# EasyEDA schematic SCH_Sega Pad - Amiga Joystick + Autofire_2021-08-13.json
TITLE: Sega Pad -> Amiga/C64 Joystick + Autofire; REV: 1.0; Date: 2021-06-16; Sheet: 1/1; Drawn By: Maciej Miklas; Company: Maciej Miklas
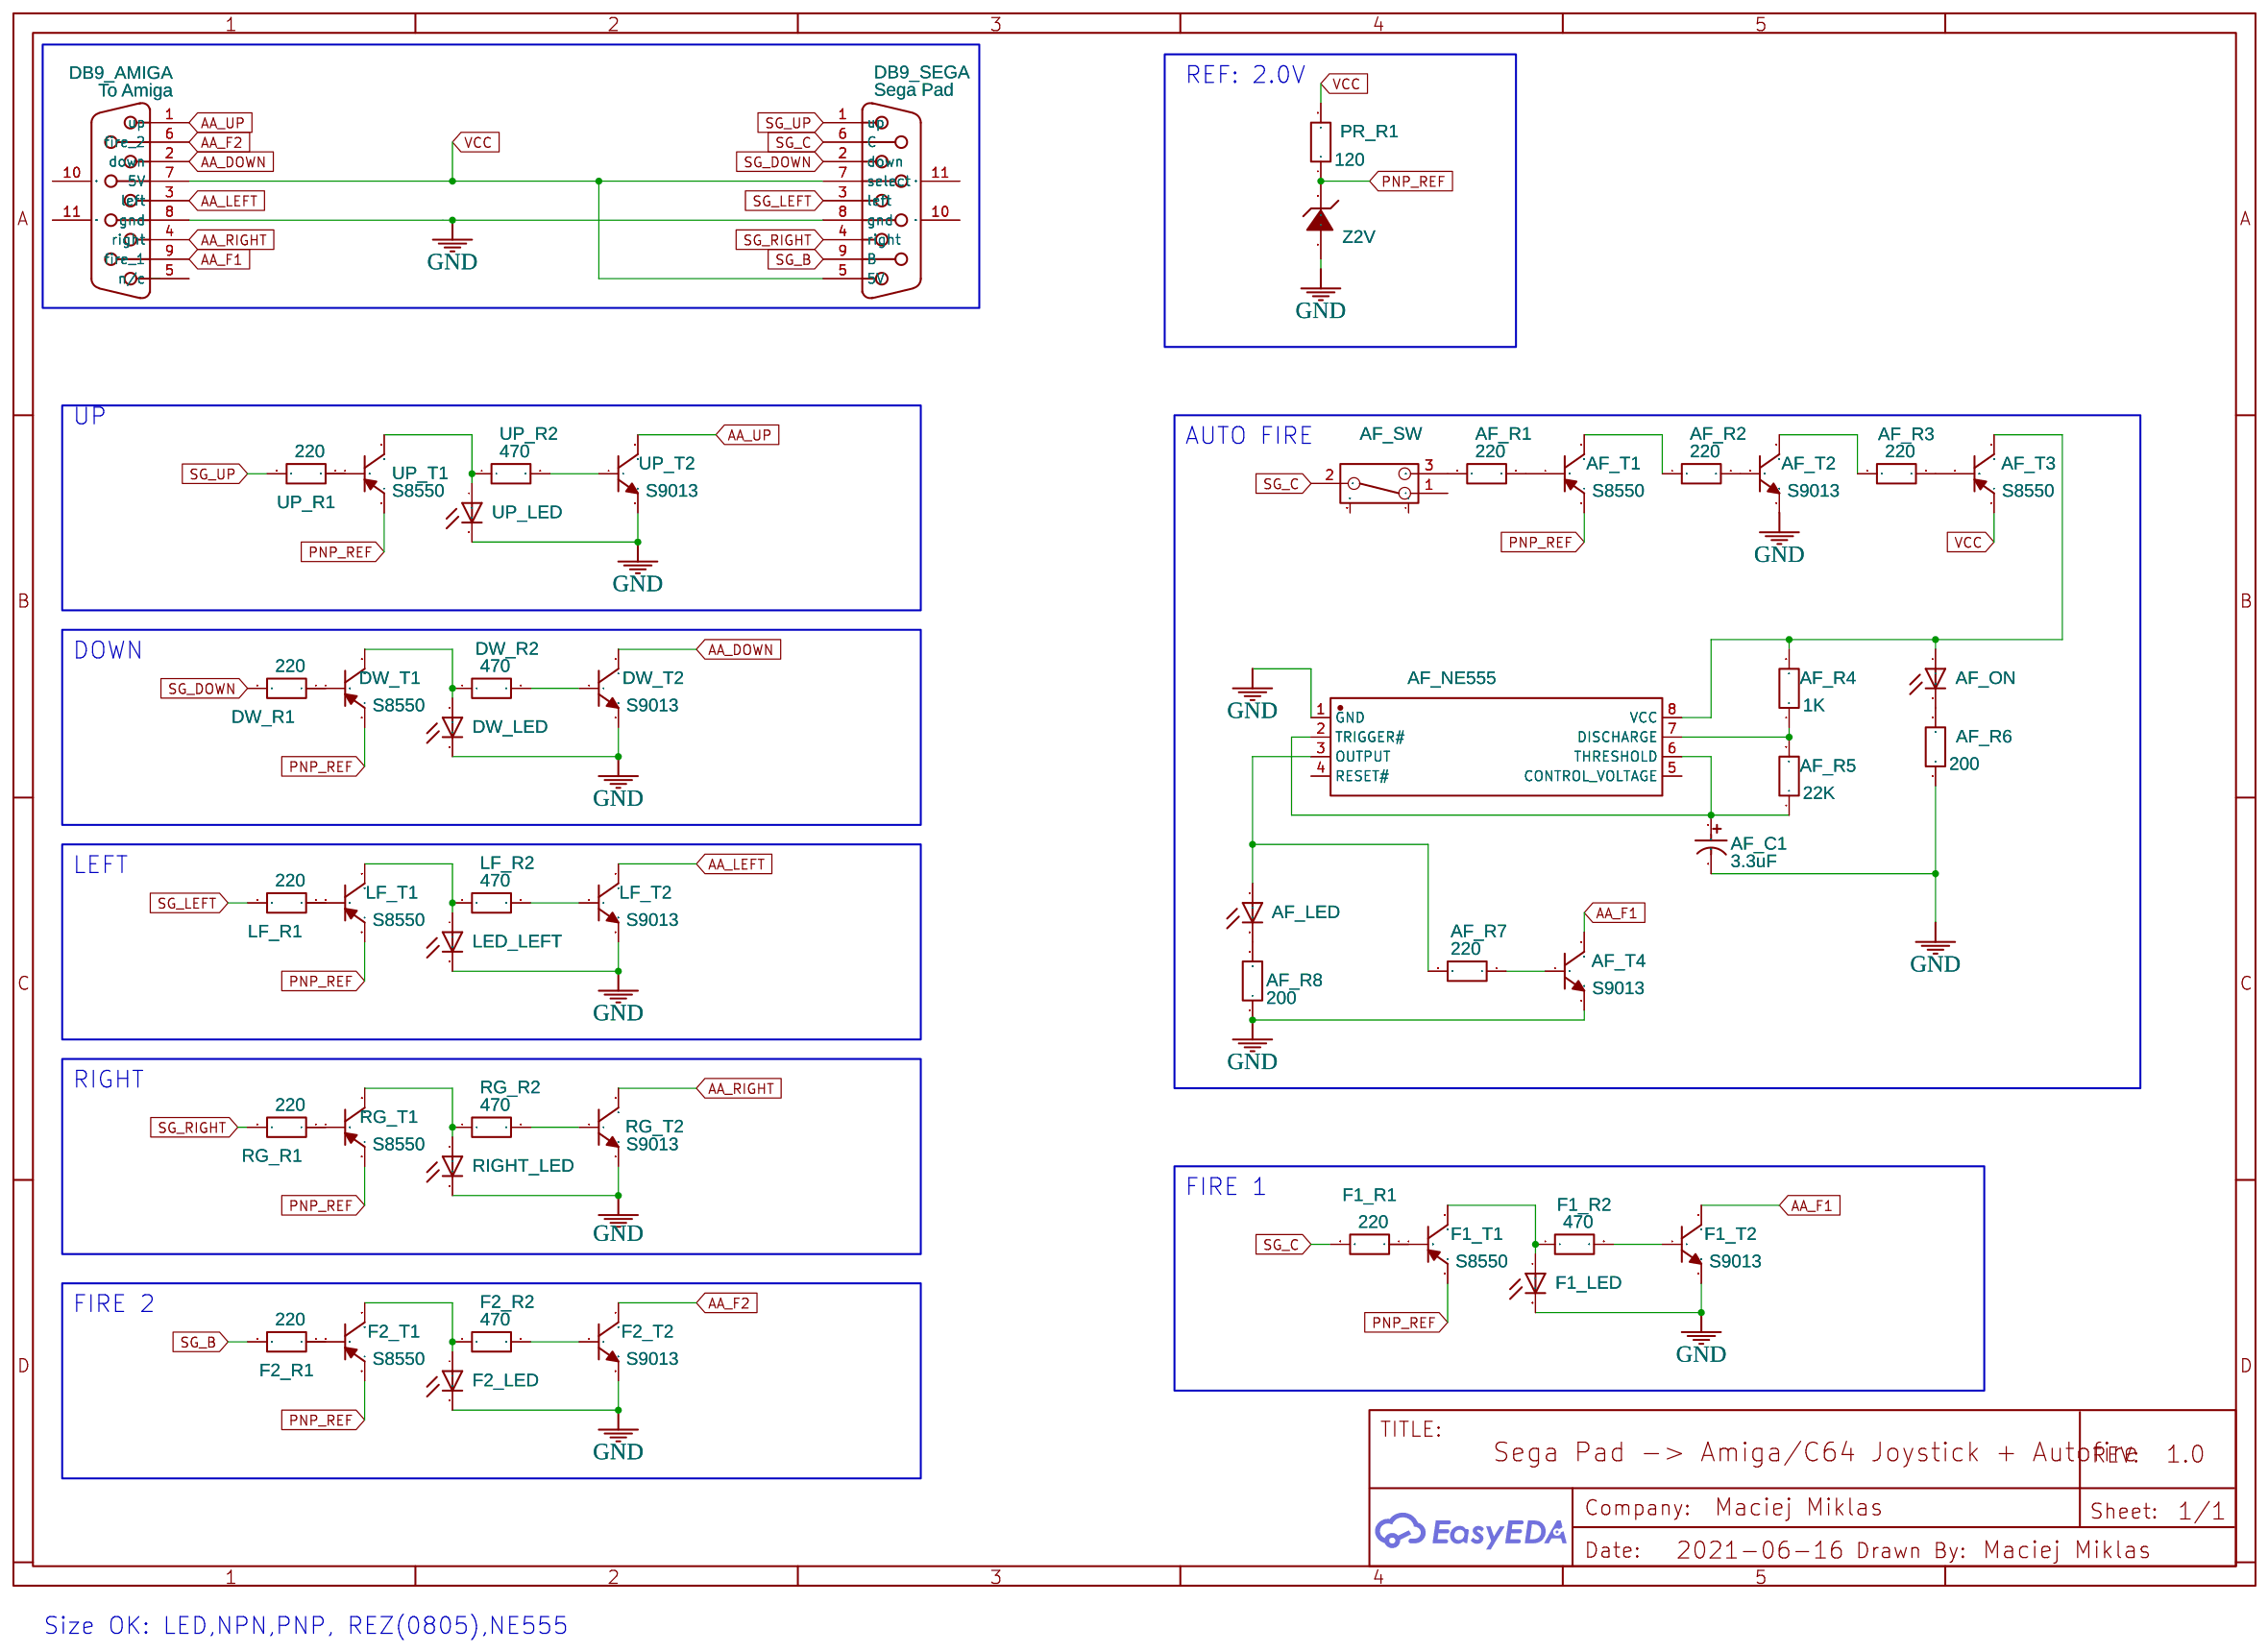
[diagram p0: schematic sheet]

## Parts
AF_555  AF_NE555  [SOP-8_L4.9-W3.9-P1.27-LS6.0-BL]
AF_C1  3.3uF  [CAP-TH_BD5.0-P2.00-D0.8-FD]
AF_LED  LED  [CHIPLED_0603]
AF_ON  LED  [CHIPLED_0603]
AF_R1  220  [R0805]
AF_R2  220  [R0805]
AF_R3  220  [R0805]
AF_R4  1K  [R0805]
AF_R5  22K  [R0805]
AF_R6  200  [R0805]
AF_R7  220  [R0805]
AF_R8  200  [R0805]
AF_SW  AUTOFIRE ON/OFF  [SW-TH_SK-12D02VG3]
AF_T1  S8550  [SOT-23-3_L2.9-W1.3-P1.90-LS2.4-BR]
AF_T2  S9013  [SOT-23-3_L2.9-W1.6-P1.90-LS2.8-BR]
AF_T3  S8550  [SOT-23-3_L2.9-W1.3-P1.90-LS2.4-BR]
AF_T4  S9013  [SOT-23-3_L2.9-W1.6-P1.90-LS2.8-BR]
DB9_AMIGA  To Amiga  [DSUB-TH_DMR-9S]
DB9_SEGA  Sega Pad  [DSUB-TH_DMR-9P]
DW_LED  LED  [CHIPLED_0603]
DW_R1  220  [R0805]
DW_R2  470  [R0805]
DW_T1  S8550  [SOT-23-3_L2.9-W1.3-P1.90-LS2.4-BR]
DW_T2  S9013  [SOT-23-3_L2.9-W1.6-P1.90-LS2.8-BR]
F1_LED  LED  [CHIPLED_0603]
F1_R1  220  [R0805]
F1_R2  470  [R0805]
F1_T1  S8550  [SOT-23-3_L2.9-W1.3-P1.90-LS2.4-BR]
F1_T2  S9013  [SOT-23-3_L2.9-W1.6-P1.90-LS2.8-BR]
F2_LED  LED  [CHIPLED_0603]
F2_R1  220  [R0805]
F2_R2  470  [R0805]
F2_T1  S8550  [SOT-23-3_L2.9-W1.3-P1.90-LS2.4-BR]
F2_T2  S9013  [SOT-23-3_L2.9-W1.6-P1.90-LS2.8-BR]
LED_LEFT  LED  [CHIPLED_0603]
LF_R1  220  [R0805]
LF_R2  470  [R0805]
LF_T1  S8550  [SOT-23-3_L2.9-W1.3-P1.90-LS2.4-BR]
LF_T2  S9013  [SOT-23-3_L2.9-W1.6-P1.90-LS2.8-BR]
PR_D1  Z2V  [LL-34_L3.5-W1.5-RD]
PR_R1  120  [R0805]
RG_R1  220  [R0805]
RG_R2  470  [R0805]
RG_T1  S8550  [SOT-23-3_L2.9-W1.3-P1.90-LS2.4-BR]
RG_T2  S9013  [SOT-23-3_L2.9-W1.6-P1.90-LS2.8-BR]
RIGHT_LED  LED  [CHIPLED_0603]
UP_LED  LED  [CHIPLED_0603]
UP_R1  220  [R0805]
UP_R2  470  [R0805]
UP_T1  S8550  [SOT-23-3_L2.9-W1.3-P1.90-LS2.4-BR]
UP_T2  S9013  [SOT-23-3_L2.9-W1.6-P1.90-LS2.8-BR]

## Library data of the parts
AF_555 = NE555D_C596355: Supplier: LCSC; Supplier Part: C596355; Manufacturer: HTC Korea TAEJIN Tech; Manufacturer Part: NE555D; Contributor: LCSC; Package Display: No
AF_C1 = 3.3uF 50V 5*11: Supplier: LCSC; Manufacturer: ValuePro; Supplier Part: C45666; JLCPCB Part Class: Extended Part
AF_LED AF_ON DW_LED F1_LED F2_LED LED_LEFT RIGHT_LED UP_LED = LED: Contributor: Adafruit; Package Display: No
AF_R1-AF_R7 DW_R1 DW_R2 F1_R1 F1_R2 F2_R1 F2_R2 LF_R1 LF_R2 PR_R1 RG_R1 RG_R2 UP_R1 UP_R2 = WR08X102 JTL: Supplier: LCSC; Supplier Part: C384174; Manufacturer: Walsin Tech Corp; Contributor: LCSC; Package Display: No
AF_R8 = WR08X102 JTL: Supplier: LCSC; Supplier Part: C384174; Manufacturer: Walsin Tech Corp; Contributor: LCSC
AF_SW = SW_SPDT: Contributor: KiCAD; Package Display: No
AF_T1 F2_T1 RG_T1 UP_T1 = S8550_C2828467: Supplier: LCSC; Supplier Part: C2828467; Manufacturer: CBI(创基); Contributor: LCSC
AF_T2 AF_T4 DW_T2 F1_T2 F2_T2 LF_T2 RG_T2 UP_T2 = S9013 120-200: Supplier: LCSC; Manufacturer: CJ; Supplier Part: C107404; JLCPCB Part Class: Extended Part; Package Display: No
AF_T3 DW_T1 F1_T1 LF_T1 = S8550_C2828467: Supplier: LCSC; Supplier Part: C2828467; Manufacturer: CBI(创基); Contributor: LCSC; Package Display: No
DB9_AMIGA = DB9_Female: Supplier Part: C141882; Supplier: LCSC; Manufacturer: Ckmtw(灿科盟); Contributor: LCEDA_Lib
DB9_SEGA = DB9_Male: Supplier Part: C185657; Supplier: LCSC; Manufacturer: Amphenol; Contributor: LCEDA_Lib
PR_D1 = ZMM2V0: Supplier: LCSC; Manufacturer: SEMTECH; Supplier Part: C8079; JLCPCB Part Class: Extended Part

## Nets
GND: AF_555.1(GND) AF_C1.2 AF_R6.1 AF_R8.1 AF_T2.2 AF_T4.2 DB9_AMIGA.8(gnd) DB9_SEGA.8(gnd) DW_LED.C DW_T2.2 F1_LED.C F1_T2.2 F2_LED.C F2_T2.2 LED_LEFT.C LF_T2.2 PR_D1.2(A) RG_T2.2 RIGHT_LED.C UP_LED.C UP_T2.2
VCC: AF_T3.2(E) DB9_AMIGA.7(5V) DB9_SEGA.5(5V) DB9_SEGA.7(select) PR_R1.2
AA_DOWN: DB9_AMIGA.2(down) DW_T2.3
AA_F1: AF_T4.3 DB9_AMIGA.9(fire 1) F1_T2.3
AA_F2: DB9_AMIGA.6(fire 2) F2_T2.3
AA_LEFT: DB9_AMIGA.3(left) LF_T2.3
AA_RIGHT: DB9_AMIGA.4(right) RG_T2.3
AA_UP: DB9_AMIGA.1(up) UP_T2.3
PNP_REF: AF_T1.2(E) DW_T1.2(E) F1_T1.2(E) F2_T1.2(E) LF_T1.2(E) PR_D1.1(C) PR_R1.1 RG_T1.2(E) UP_T1.2(E)
SG_B: DB9_SEGA.9(B) F2_R1.2
SG_C: AF_SW.2 DB9_SEGA.6(C) F1_R1.2
SG_DOWN: DB9_SEGA.2(down) DW_R1.2
SG_LEFT: DB9_SEGA.3(left) LF_R1.2
SG_RIGHT: DB9_SEGA.4(right) RG_R1.2
SG_UP: DB9_SEGA.1(up) UP_R1.2
Net-(AF_555-2): AF_555.2(TRIGGER#) AF_555.6(THRESHOLD) AF_C1.1 AF_R5.1
Net-(AF_555-3): AF_555.3(OUTPUT) AF_LED.A AF_R7.2
Net-(AF_555-7): AF_555.7(DISCHARGE) AF_R4.1 AF_R5.2
Net-(AF_555-8): AF_555.8(VCC) AF_ON.A AF_R4.2 AF_T3.3(C)
Net-(AF_LED-C): AF_LED.C AF_R8.2
Net-(AF_ON-C): AF_ON.C AF_R6.2
Net-(AF_R1-1): AF_R1.1 AF_T1.1(B)
Net-(AF_R1-2): AF_R1.2 AF_SW.3
Net-(AF_R2-1): AF_R2.1 AF_T1.3(C)
Net-(AF_R2-2): AF_R2.2 AF_T2.1
Net-(AF_R3-1): AF_R3.1 AF_T2.3
Net-(AF_R3-2): AF_R3.2 AF_T3.1(B)
Net-(AF_R7-1): AF_R7.1 AF_T4.1
Net-(DW_LED-A): DW_LED.A DW_R2.1 DW_T1.3(C)
Net-(DW_R1-1): DW_R1.1 DW_T1.1(B)
Net-(DW_R2-2): DW_R2.2 DW_T2.1
Net-(F1_LED-A): F1_LED.A F1_R2.1 F1_T1.3(C)
Net-(F1_R1-1): F1_R1.1 F1_T1.1(B)
Net-(F1_R2-2): F1_R2.2 F1_T2.1
Net-(F2_LED-A): F2_LED.A F2_R2.1 F2_T1.3(C)
Net-(F2_R1-1): F2_R1.1 F2_T1.1(B)
Net-(F2_R2-2): F2_R2.2 F2_T2.1
Net-(LED_LEFT-A): LED_LEFT.A LF_R2.1 LF_T1.3(C)
Net-(LF_R1-1): LF_R1.1 LF_T1.1(B)
Net-(LF_R2-2): LF_R2.2 LF_T2.1
Net-(RG_R1-1): RG_R1.1 RG_T1.1(B)
Net-(RG_R2-1): RG_R2.1 RG_T1.3(C) RIGHT_LED.A
Net-(RG_R2-2): RG_R2.2 RG_T2.1
Net-(UP_LED-A): UP_LED.A UP_R2.1 UP_T1.3(C)
Net-(UP_R1-1): UP_R1.1 UP_T1.1(B)
Net-(UP_R2-2): UP_R2.2 UP_T2.1

Not connected (* = marked no-connect by the designer): AF_555 4(RESET#) 5(CONTROL VOLTAGE); AF_SW 1 4 5; DB9_AMIGA 5(n/c) 10(MH1) 11(MH2); DB9_SEGA 10(MH1) 11(MH2)

## Notes on the sheet
- REF: 2.0V
- UP
- AUTO FIRE
- DOWN
- LEFT
- RIGHT
- FIRE 1
- FIRE 2
- Size OK: LED,NPN,PNP, REZ(0805),NE555
